# Altium schematic sheet Sensors_ADC.SchDoc
size A4
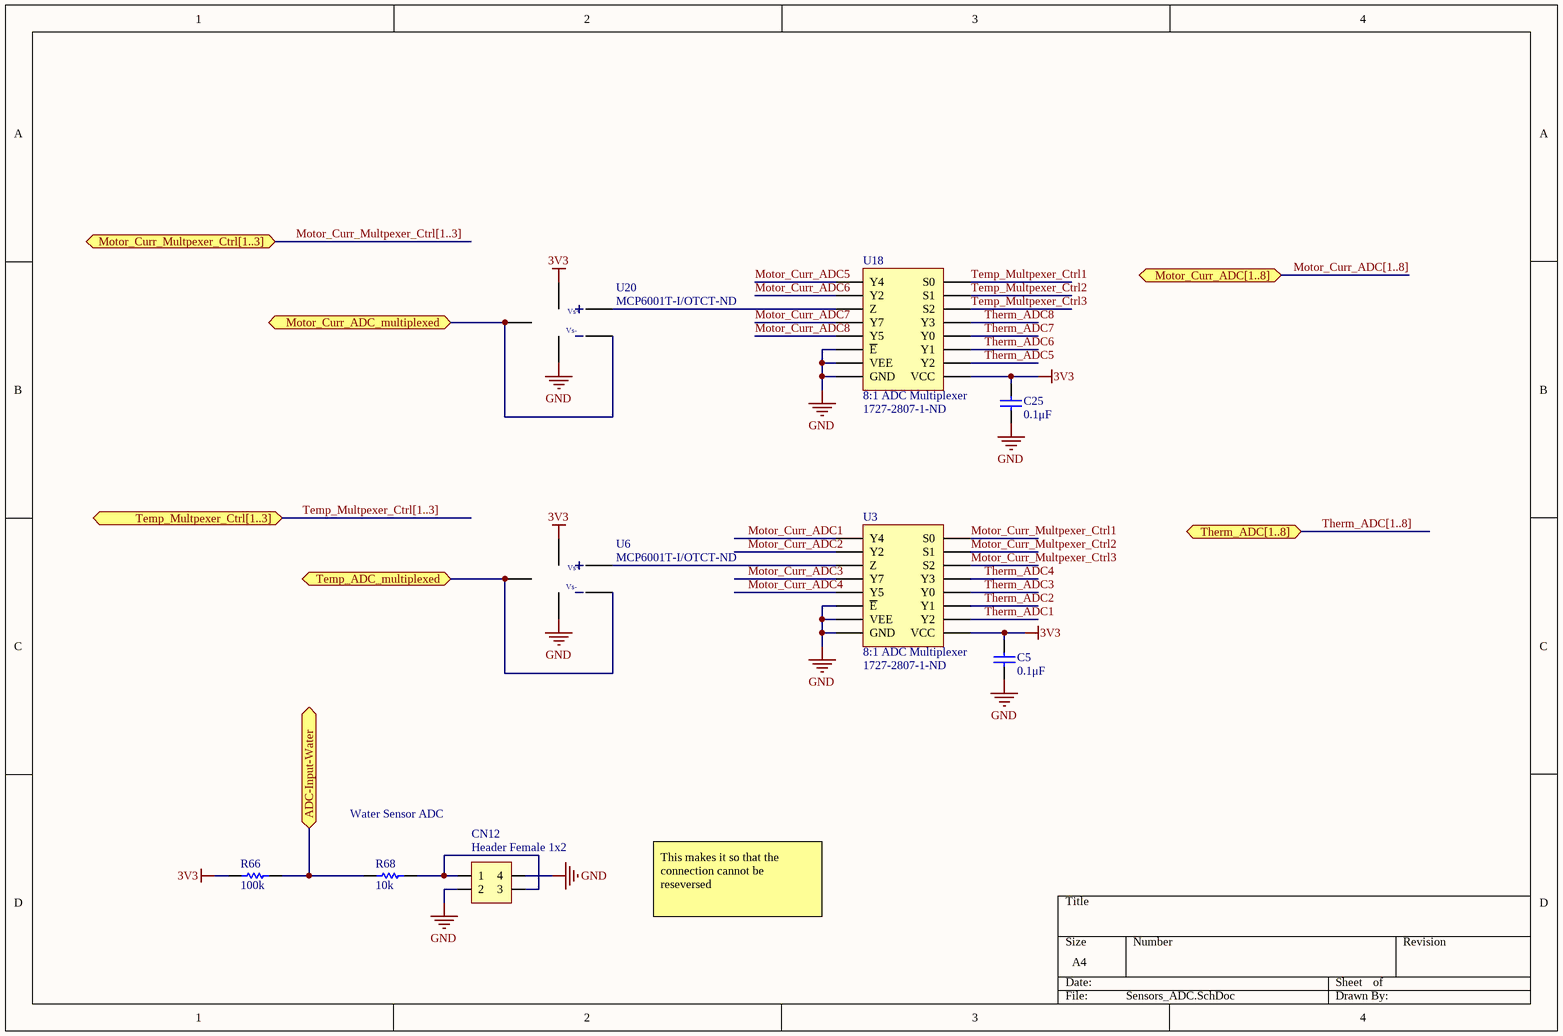
[diagram p0: Sensors_ADC.SchDoc]

## Parts
C5  0.1μF  [CAPC1608N(0603")]
C25  0.1μF  [CAPC1608N(0603")]
CN12  Header Female 1x2  [Header, Female, 2x2, THT]
R66  100k  [RESC1608N(0603")]
R68  10k  [RESC1608N(0603")]
U3  8:1 ADC Multiplexer  Supplier Part Number 1: 1727-2807-1-ND  [SOIC-16]
U6  Supplier Part Number 1: MCP6001T-I/OTCT-ND  [SOT23-5]  (hidden comment: Op amp 1.8-6V rail-to-rail (SOT23-5))
U18  8:1 ADC Multiplexer  Supplier Part Number 1: 1727-2807-1-ND  [SOIC-16]
U20  Supplier Part Number 1: MCP6001T-I/OTCT-ND  [SOT23-5]  (hidden comment: Op amp 1.8-6V rail-to-rail (SOT23-5))

## Ports
ADC-Input-Water, Motor_Curr_ADC[1..8], Motor_Curr_ADC_multiplexed, Motor_Curr_Multpexer_Ctrl[1..3], Temp_ADC_multiplexed, Temp_Multpexer_Ctrl[1..3], Therm_ADC[1..8]

## Nets
3V3: C5.2(Cathode) C25.2(Cathode) R66.1 U3.16(VCC) U6.5(Vcc_+) U18.16(VCC) U20.5(Vcc_+)
GND: C5.1(Anode) C25.1(Anode) CN12.2 CN12.4 U3.6(~{E}) U3.7(VEE) U3.8(GND) U6.2(Vcc-) U18.6(~{E}) U18.7(VEE) U18.8(GND) U20.2(Vcc-)
ADC-Input-Water: R66.2 R68.1 ; port ADC-Input-Water
Motor_Curr_ADC1: U3.1(Y4)
Motor_Curr_ADC2: U3.2(Y2)
Motor_Curr_ADC3: U3.4(Y7)
Motor_Curr_ADC4: U3.5(Y5)
Motor_Curr_ADC5: U18.1(Y4)
Motor_Curr_ADC6: U18.2(Y2)
Motor_Curr_ADC7: U18.4(Y7)
Motor_Curr_ADC8: U18.5(Y5)
Motor_Curr_ADC_multiplexed: U20.1(Out) U20.4(V-) ; port Motor_Curr_ADC_multiplexed
Motor_Curr_Multpexer_Ctrl1: U3.9(S0)
Motor_Curr_Multpexer_Ctrl2: U3.10(S1)
Motor_Curr_Multpexer_Ctrl3: U3.11(S2)
Temp_ADC_multiplexed: U6.1(Out) U6.4(V-) ; port Temp_ADC_multiplexed
Temp_Multpexer_Ctrl1: U18.9(S0)
Temp_Multpexer_Ctrl2: U18.10(S1)
Temp_Multpexer_Ctrl3: U18.11(S2)
Therm_ADC1: U3.15(Y2)
Therm_ADC2: U3.14(Y1)
Therm_ADC3: U3.13(Y0)
Therm_ADC4: U3.12(Y3)
Therm_ADC5: U18.15(Y2)
Therm_ADC6: U18.14(Y1)
Therm_ADC7: U18.13(Y0)
Therm_ADC8: U18.12(Y3)
NetCN12_1: CN12.1 CN12.3 R68.2
NetU3_3: U3.3(Z) U6.3(V+)
NetU18_3: U18.3(Z) U20.3(V+)

## Buses and harness runs
bus Motor_Curr_ADC[1..8] = port Motor_Curr_ADC[1..8]
bus Motor_Curr_Multpexer_Ctrl[1..3] = port Motor_Curr_Multpexer_Ctrl[1..3]
bus Temp_Multpexer_Ctrl[1..3] = port Temp_Multpexer_Ctrl[1..3]
bus Therm_ADC[1..8] = port Therm_ADC[1..8]

## Notes on the sheet
- Water Sensor ADC
- This makes it so that the connection cannot be reseversed
- (in symbol Op amp 1.8-6V rail-to-rail (SOT23-5)) Vs+; Vs-

## Library data of the parts
C5 C25 = 0.1uF 100V 0603 SMD, Ceramic: Capacitor, Ceramic, 100V, +/- 10%, 0603 SMD, X7R; MFG: TDK; MFG#: CGA3E3X7S2A104K080AB; Published: 16-04-26; Publisher: AUVic; PackageDescription: Chip Capacitor; Value: 0.1μF; Created By: Ashwin Sira; Supplier 1: Digi-Key; Supplier Part Number 1: 445-6938-1-ND
CN12 = Header, Female, 2x2: 2x2, Pads Pitch: 0.1" (2.54mm), Through hole; Made Bates: Andy Bates; Supplier 1: Digi-Key; Supplier Part Number 1: S7105-ND
R66 = 100kR, 1%, 1/10W, 0603 SMD: Made By: Andy Bates; Owned By: AUVic; Created On: 14-06-30; Last Edited: 14-06-30; Value: 100k; Supplier 1: Digi-Key; Supplier Part Number 1: 311-100KGRCT-ND
R68 = 10kR, 1%, 1/10W, 0603 SMD: Made By: Ashwin Sira; Owned By: AUVic; Created On: 14-05-31; Last Edited: 14-05-31; Supplier 1: Digi-Key; Supplier Part Number 1: 311-10.0KHRCT-ND; Value: 10k
U3 U18 = 74HC4051D,653: Made by: Andy Bates; Created on: 2019/09/08; Supplier 1: Digi-Key
U6 U20 = Op amp 1.8-6V rail-to-rail (SOT23-5): Made by: Andy Bates; Created on: 05/10/2017; Supplier 1: Digi-Key